# Altium schematic sheet RP2040 with CAN.SchDoc: Sample Sheet Title
size B; Date: MM/DD/YYYY; Author: Sample Author; Organization: ORGANIZATION; Address1: ADDRESS 1; Address2: ADDRESS 2; Address3: ADDRESS 3; Address4: ADDRESS 4; Revision: -; SheetNumber: 1; SheetTotal: 2; ENG_APP_DATE: --/--/--; DSN_APP_DATE: --/--/--; CHK_APP_DATE: --/--/--
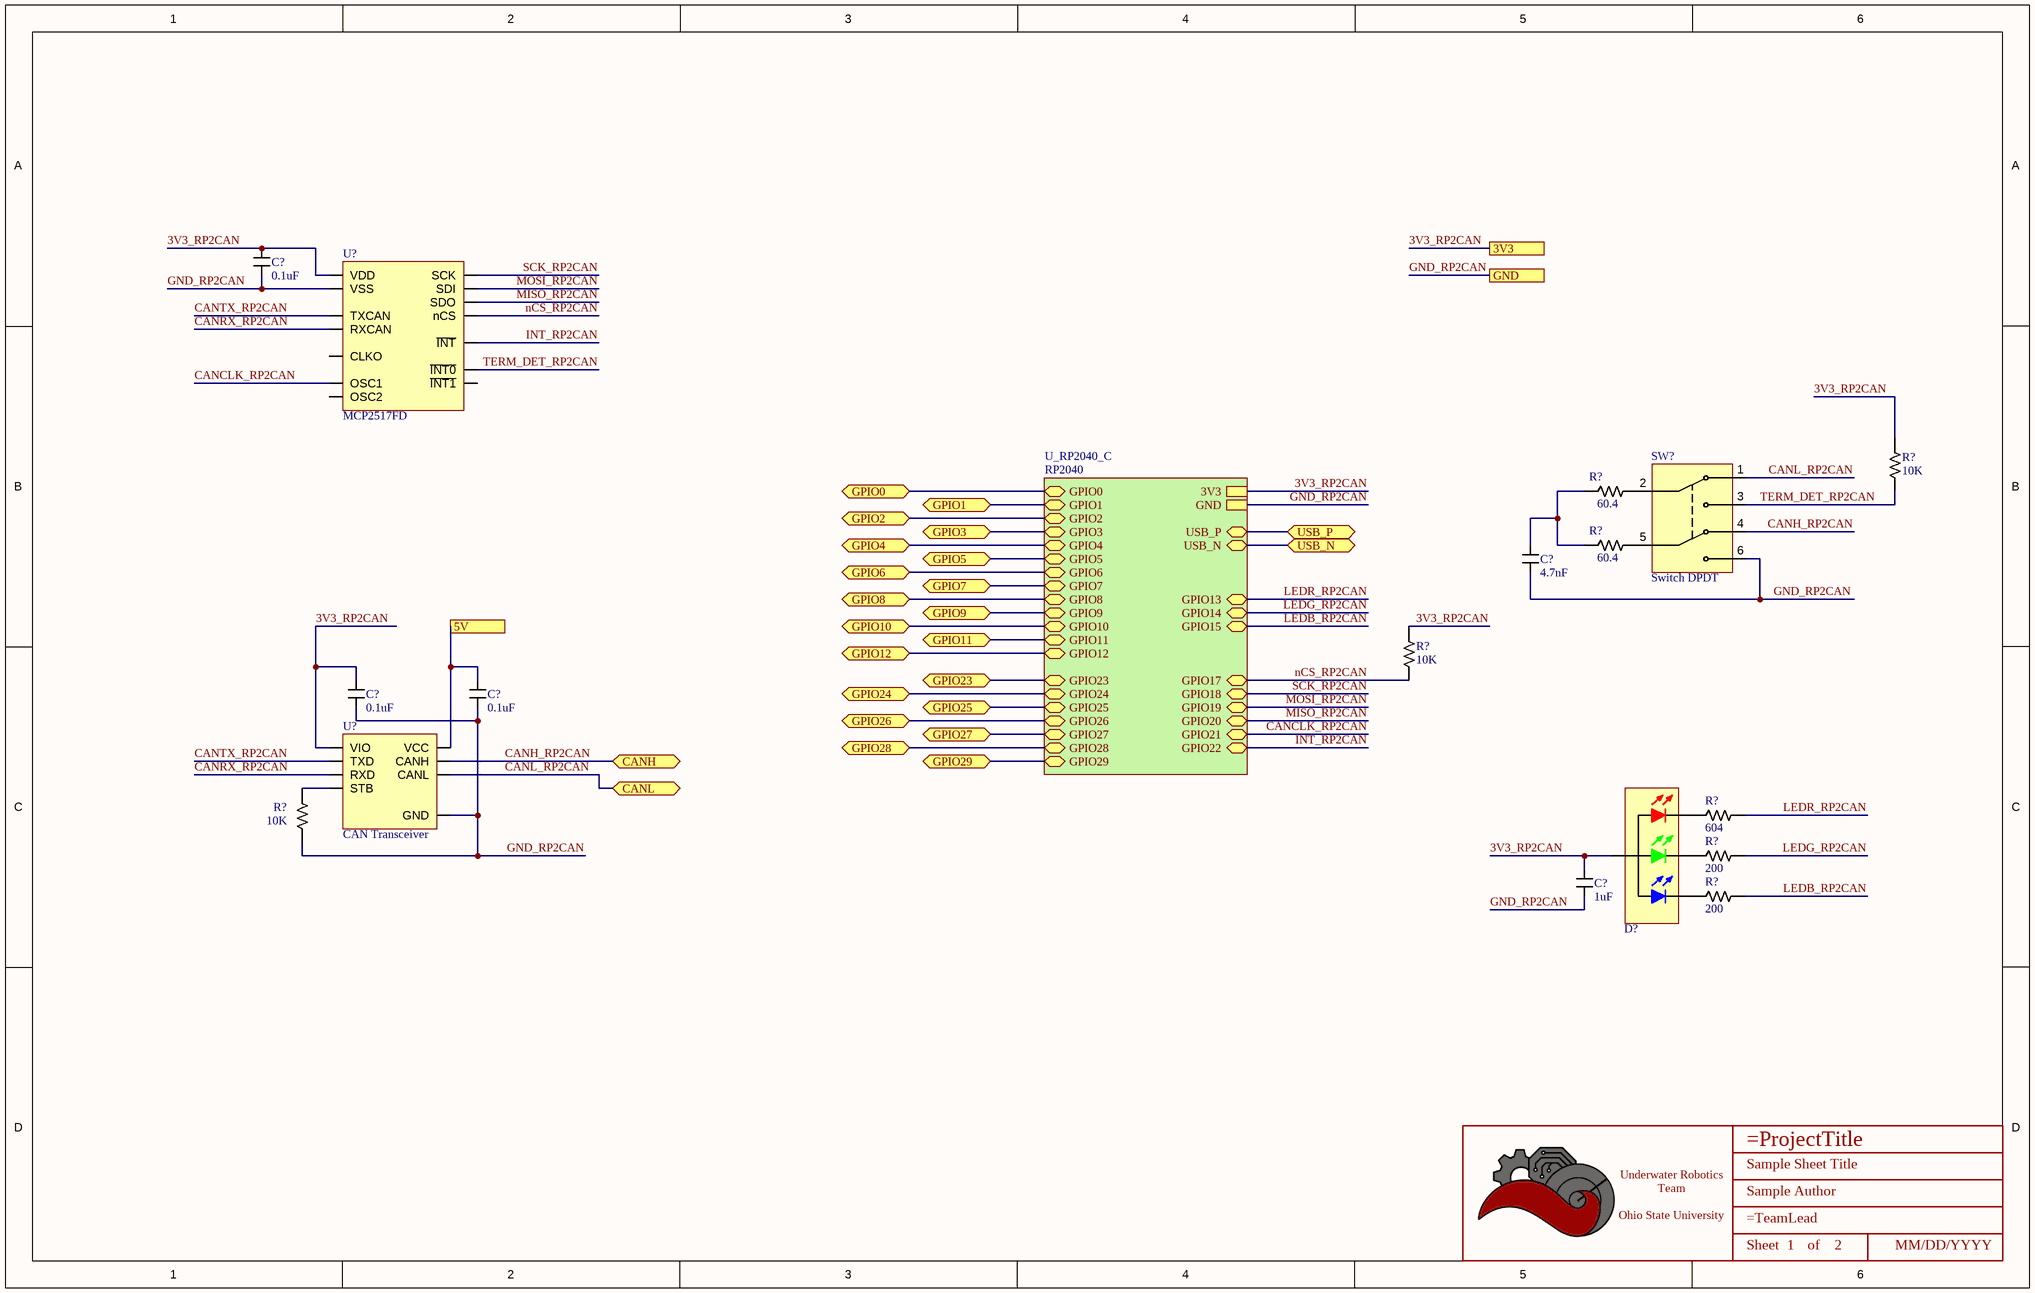
[diagram p0: RP2040 with CAN.SchDoc]

## Parts
(Parts that share a designator on the sheet are numbered #1, #2 ... from top to bottom, then left to right.)
*  Title_Block  [LOGO]  (value not drawn)  (graphical)
C?#1  value 0.1uF  [CAPACITOR_0402]  (hidden comment: 100nF Ceramic 25V)
C?#2  value 4.7nF  [CAPACITOR_0402]  (hidden comment: 4700pF Ceramic 25V)
C?#3  value 0.1uF  [CAPACITOR_0402]  (hidden comment: 100nF Ceramic 25V)
C?#4  value 0.1uF  [CAPACITOR_0402]  (hidden comment: 100nF Ceramic 25V)
C?#5  value 1uF  [CAPACITOR_0402]  (hidden comment: 1uF Ceramic 16V)
D?  EAST1616RGBB4  [LED_0606_4SMD]  (value not drawn)
R?#1  Value  (Ohms): 10K  [RESISTOR_0402]  (hidden comment: 10k Ohm 1% 1/16W)
R?#2  Value  (Ohms): 60.4  [RESISTOR_0402]  (hidden comment: 60.4 Ohm 1% 1/16W)
R?#3  Value  (Ohms): 60.4  [RESISTOR_0402]  (hidden comment: 60.4 Ohm 1% 1/16W)
R?#4  Value  (Ohms): 10K  [RESISTOR_0402]  (hidden comment: 10k Ohm 1% 1/16W)
R?#5  Value  (Ohms): 10K  [RESISTOR_0402]  (hidden comment: 10k Ohm 1% 1/16W)
R?#6  Value  (Ohms): 604  [RESISTOR_0402]  (hidden comment: 604 Ohm 1% 1/16W)
R?#7  Value  (Ohms): 200  [RESISTOR_0402]  (hidden comment: 200 Ohm 1% 1/16W)
R?#8  Value  (Ohms): 200  [RESISTOR_0402]  (hidden comment: 200 Ohm 1% 1/16W)
SW?  Switch DPDT  [CAS-220TA]
U?#1  MCP2517FD  [SOIC-14]
U?#2  CAN Transceiver  [SOIC-8]

## Sub-sheets
U_RP2040_C = RP2040: GPIO0 (bidir), GPIO1 (bidir), GPIO2 (bidir), GPIO3 (bidir), GPIO4 (bidir), GPIO5 (bidir), GPIO6 (bidir), GPIO7 (bidir), GPIO8 (bidir), GPIO9 (bidir), GPIO10 (bidir), GPIO11 (bidir), GPIO12 (bidir), GPIO13 (bidir), GPIO14 (bidir), GPIO15 (bidir), GPIO17 (bidir), GPIO18 (bidir), GPIO19 (bidir), GPIO20 (bidir), GPIO21 (bidir), GPIO22 (bidir), GPIO23 (bidir), GPIO24 (bidir), GPIO25 (bidir), GPIO26 (bidir), GPIO27 (bidir), GPIO28 (bidir), GPIO29 (bidir), 3V3, GND, USB_P (bidir), USB_N (bidir)

## Ports
3V3, 5V, CANH (bidir), CANL (bidir), GND, GPIO0 (bidir), GPIO1 (bidir), GPIO2 (bidir), GPIO3 (bidir), GPIO4 (bidir), GPIO5 (bidir), GPIO6 (bidir), GPIO7 (bidir), GPIO8 (bidir), GPIO9 (bidir), GPIO10 (bidir), GPIO11 (bidir), GPIO12 (bidir), GPIO23 (bidir), GPIO24 (bidir), GPIO25 (bidir), GPIO26 (bidir), GPIO27 (bidir), GPIO28 (bidir), GPIO29 (bidir), USB_N (bidir), USB_P (bidir)

## Nets
3V3_RP2CAN: C?#1.1 C?#3.1 C?#5.1 D?.4 R?#1.1 R?#4.1 U?#1.14(VDD) U?#2.5(VIO) ; port 3V3, sheet U_RP2040_C/3V3
5V: C?#4.1 U?#2.3(VCC) ; port 5V
CANCLK_RP2CAN: U?#1.6(OSC1) ; sheet U_RP2040_C/GPIO21
CANH_RP2CAN: SW?.4 U?#2.7(CANH) ; port CANH
CANL_RP2CAN: SW?.1 U?#2.6(CANL) ; port CANL
CANRX_RP2CAN: U?#1.2(RXCAN) U?#2.4(RXD)
CANTX_RP2CAN: U?#1.1(TXCAN) U?#2.1(TXD)
GND_RP2CAN: C?#1.2 C?#2.1 C?#3.2 C?#4.2 C?#5.2 R?#5.2 SW?.6 U?#1.7(VSS) U?#2.2(GND) ; port GND, sheet U_RP2040_C/GND
GPIO0: port GPIO0, sheet U_RP2040_C/GPIO0
GPIO1: port GPIO1, sheet U_RP2040_C/GPIO1
GPIO2: port GPIO2, sheet U_RP2040_C/GPIO2
GPIO3: port GPIO3, sheet U_RP2040_C/GPIO3
GPIO4: port GPIO4, sheet U_RP2040_C/GPIO4
GPIO5: port GPIO5, sheet U_RP2040_C/GPIO5
GPIO6: port GPIO6, sheet U_RP2040_C/GPIO6
GPIO7: port GPIO7, sheet U_RP2040_C/GPIO7
GPIO8: port GPIO8, sheet U_RP2040_C/GPIO8
GPIO9: port GPIO9, sheet U_RP2040_C/GPIO9
GPIO10: port GPIO10, sheet U_RP2040_C/GPIO10
GPIO11: port GPIO11, sheet U_RP2040_C/GPIO11
GPIO12: port GPIO12, sheet U_RP2040_C/GPIO12
GPIO23: port GPIO23, sheet U_RP2040_C/GPIO23
GPIO24: port GPIO24, sheet U_RP2040_C/GPIO24
GPIO25: port GPIO25, sheet U_RP2040_C/GPIO25
GPIO26: port GPIO26, sheet U_RP2040_C/GPIO26
GPIO27: port GPIO27, sheet U_RP2040_C/GPIO27
GPIO28: port GPIO28, sheet U_RP2040_C/GPIO28
GPIO29: port GPIO29, sheet U_RP2040_C/GPIO29
INT_RP2CAN: U?#1.4(~{INT}) ; sheet U_RP2040_C/GPIO22
LEDB_RP2CAN: R?#8.1 ; sheet U_RP2040_C/GPIO15
LEDG_RP2CAN: R?#7.1 ; sheet U_RP2040_C/GPIO14
LEDR_RP2CAN: R?#6.1 ; sheet U_RP2040_C/GPIO13
MISO_RP2CAN: U?#1.12(SDO) ; sheet U_RP2040_C/GPIO20
MOSI_RP2CAN: U?#1.11(SDI) ; sheet U_RP2040_C/GPIO19
nCS_RP2CAN: R?#4.2 U?#1.13(nCS) ; sheet U_RP2040_C/GPIO17
SCK_RP2CAN: U?#1.10(SCK) ; sheet U_RP2040_C/GPIO18
TERM_DET_RP2CAN: R?#1.2 SW?.3 U?#1.9(~{INT0})
USB_N: port USB_N, sheet U_RP2040_C/USB_N
USB_P: port USB_P, sheet U_RP2040_C/USB_P
NetC?#2_2: C?#2.2 R?#2.2 R?#3.2
NetD?_1: D?.1 R?#6.2
NetD?_2: D?.2 R?#7.2
NetD?_3: D?.3 R?#8.2
NetR?#2_1: R?#2.1 SW?.2
NetR?#3_1: R?#3.1 SW?.5
NetR?#5_1: R?#5.1 U?#2.8(STB)

Not connected (* = marked no-connect by the designer): U?#1 3(CLKO) 5(OSC2) 8(~{INT1})

## Notes on the sheet
- DWG. NO.
- REV.
- SHT.
- THIS DOCUMENT AND THE DATA DISCLOSED HEREIN OR HEREWITH IS THE PROPERTY OF ALTIUM LIMITED AND MAY BE FREELY DISTRIBUTED IN WHOLE. NO RIGHTS ARE RESERVED OR EXPRESS OR IMPLIED WARANTEE GIVEN.
- REVISION
- DESCRIPTION
- DATE
- APPROVED
- ENG:
- APPROVALS
- PROJECT
- DSN:
- CHK:
- REFERENCE DOCUMENTS
- PROJECT REVISION:
- TITLE
- DOCUMENT REVISION:
- DESIGN ITEM:
- BOM:
- FAB DWG:
- PCB DWG:
- ASSY DWG:
- SCALE:
- SIZE
- B
- CAGE CODE
- FILE NAME
- DWG NO.
- SHEET
- OF
- REV
- (in symbol Title_Block) Underwater Robotics Team / Ohio State University; Sheet; of

## Library data of the parts
* = Title_Block: UWRT Schematic Title Block Template / Created June 2021, Dylan Trainor
C?#1 C?#3 C?#4 = CAPACITOR_0.1uF_0402: Cap 100nF 25V +/-10% / Ceramic 0402; Made By: Robert Pafford; Tolerance: +/- 10%; Voltage: 25V; Supplier 1: Digi-Key; Supplier Part Number 1: 478-7868-1-ND
C?#2 = CAPACITOR_0.0047uF_0402: 4700 pF +/-10% 25V Ceramic Capacitor X7R 0402; Made By: Robert Pafford; Tolerance: +/- 10%; Voltage: 25V; Supplier 1: Digi-Key; Supplier Part Number 1: 478-6195-1-ND
C?#5 = CAPACITOR_1uF_0402: Cap 1uF 16V +/-10% / Ceramic 0402; Made By: Robert Pafford; Tolerance: +/- 10%; Voltage: 16V; Supplier 1: Digi-Key; Supplier Part Number 1: 478-0402YD105KAT4ADKR-ND
D? = LED_RGB_4SMD: LED RGB CLEAR 4SMD; Made By: Robert Pafford; Red Forward Voltage: 1.8V; Red Forward Current: 5mA; Green Forward Voltage: 2.8V; ComponentLink1Description: Datasheet; ComponentLink1URL: https://everlightamericas.com/index.php?controller=attachment&id_attachment=3220; Package: 4-SMD; Green Forward Current: 5mA; Blue Forward Voltage: 2.8V; Blue Forward Current: 5mA; Color: RGB; Supplier 1: Digi-Key; Supplier Part Number 1: 1080-1552-1-ND
R?#1 R?#4 R?#5 = RESISTOR_10K_0402: RES 10k OHM 1% 1/16W 0402; Tolerance: +/- 1%; Made By: Robert Pafford; Wattage: 1/16W; Supplier: Digikey; Digikey Part Numer: CR0603-JW-104ELFTR-ND; Supplier 1: Digi-Key; Supplier Part Number 1: YAG3436CT-ND
R?#2 R?#3 = RESISTOR_60.4_0402: RES 60.4 OHM 1% 1/16W 0402; Tolerance: +/- 1%; Made By: Robert Pafford; Wattage: 1/16W; Supplier: Digikey; Digikey Part Numer: CR0603-JW-104ELFTR-ND; Supplier 1: Digi-Key; Supplier Part Number 1: 13-AC0402FR-0760R4LCT-ND
R?#6 = RESISTOR_604_0402: RES 604 OHM 1% 1/16W 0402; Tolerance: +/- 1%; Made By: Robert Pafford; Wattage: 1/16W; Supplier: Digikey; Digikey Part Numer: CR0603-JW-104ELFTR-ND; Supplier 1: Digi-Key; Supplier Part Number 1: 13-AC0402FR-07604RLCT-ND
R?#7 R?#8 = RESISTOR_200_0402: RES 200 OHM 1% 1/16W 0402; Tolerance: +/- 1%; Made By: Robert Pafford; Wattage: 1/16W; Supplier: Digikey; Digikey Part Numer: CR0603-JW-104ELFTR-ND; Supplier 1: Digi-Key; Supplier Part Number 1: YAG3453CT-ND
SW? = CAS-220TA_CAN_TERM: GOLD SWITCH FLUSH SLIDE DPDT 100MA 6V; Made By: Robert Pafford; Voltage Rating: 6VDC; Current Rating: 100 mA; Switch Function: DPDT; Contact Finish: Gold; Supplier 1: Digi-Key; Supplier Part Number 1: CAS220JCT-ND
U?#1 = MCP2517FD: CANbus Controller CAN 2.0 SPI Interface 14-SOIC; Made By: Robert Pafford; Max FD Rate: 8 Mbps
U?#2 = TJA1442AT: CAN Interface IC High-Speed CAN Transceiver with Standby Mode; Made By: Robert Pafford; Max Data Rate: 5Mbps; Supplier 1: Mouser; Supplier Part Number 1: 771-TJA1442AT/0Z